# Altium project Cube_Sensor.PrjPcb
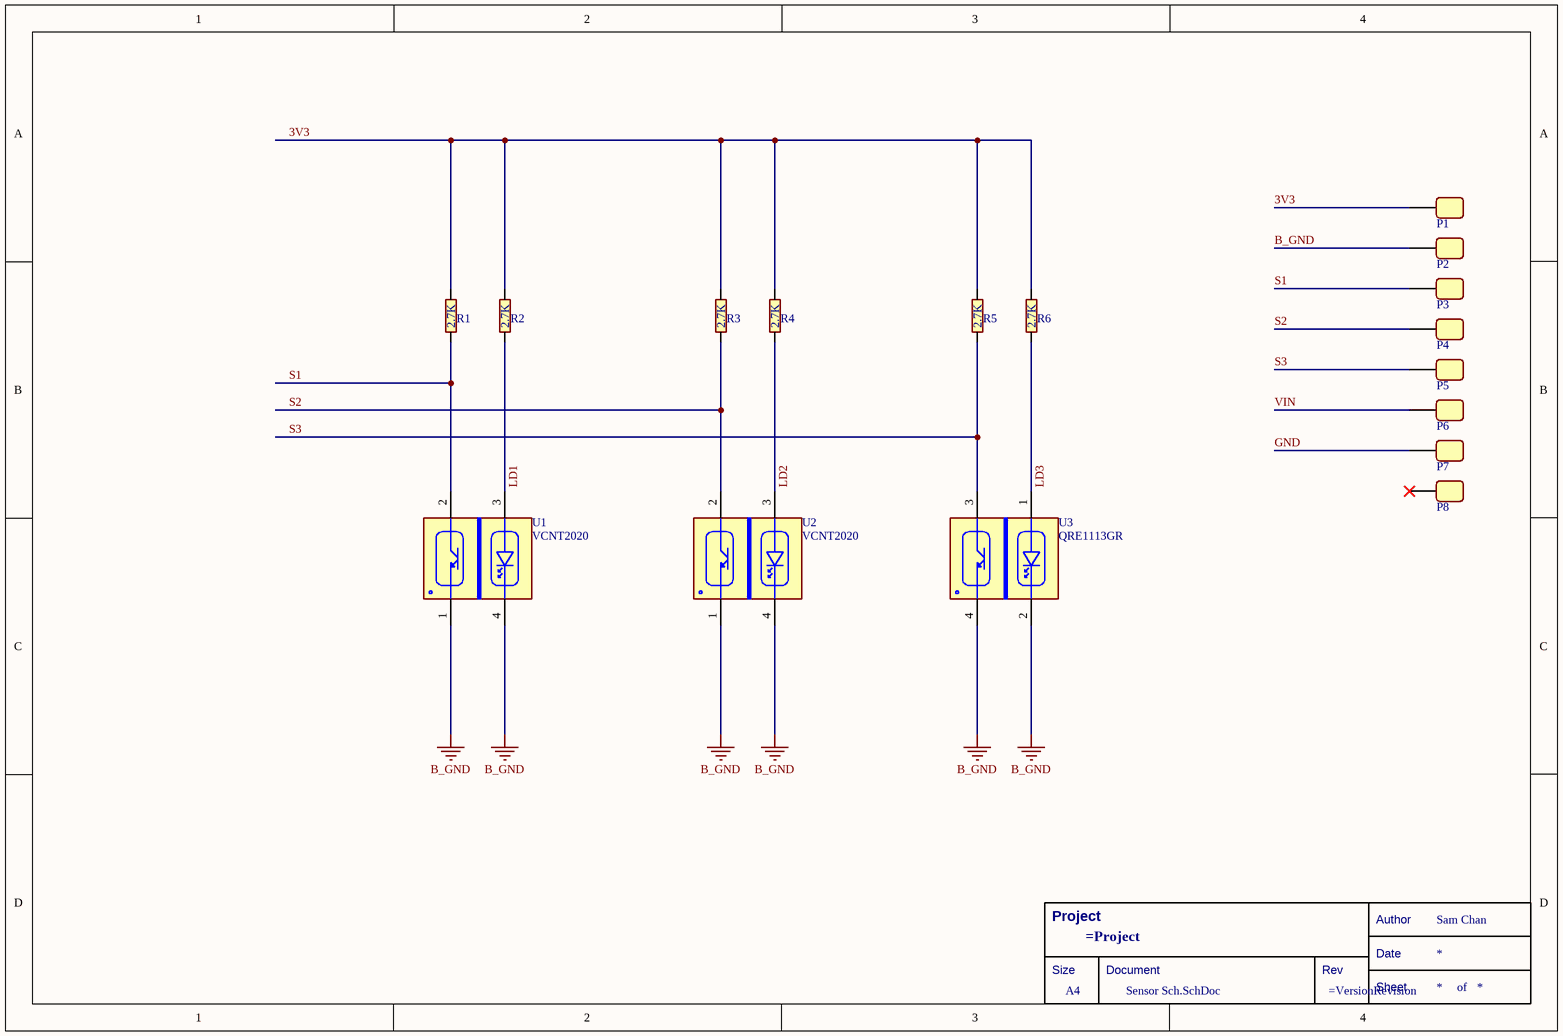
[diagram p0: Sensor Sch.SchDoc]
1 sheet, 18 parts. Net scope: global (net labels, ports and power ports of the same name join across sheets).
Board files: A PCB.PcbDoc, B PCB.PcbDoc, C PCB.PcbDoc

## Sheet Sensor Sch.SchDoc
size A4

### Parts
*  Title Block  (value not drawn)  (graphical)
P1  PAD_4  [PAD_0.5X1MM]  (value not drawn)  (no BOM)
P2  PAD_4  [PAD_0.5X1MM]  (value not drawn)  (no BOM)
P3  PAD_4  [PAD_0.5X1MM]  (value not drawn)  (no BOM)
P4  PAD_4  [PAD_0.5X1MM]  (value not drawn)  (no BOM)
P5  PAD_4  [PAD_0.5X1MM]  (value not drawn)  (no BOM)
P6  PAD_4  [PAD_0.5X1MM]  (value not drawn)  (no BOM)
P7  PAD_4  [PAD_0.5X1MM]  (value not drawn)  (no BOM)
P8  PAD_4  [PAD_0.5X1MM]  (value not drawn)  (no BOM)
R1  2.7K  [RESC0402X04N]
R2  2.7K  [RESC0402X04N]
R3  2.7K  [RESC0402X04N]
R4  2.7K  [RESC0402X04N]
R5  2.7K  [RESC0402X04N]
R6  2.7K  [RESC0402X04N]
U1  VCNT2020  [VCNT2020]
U2  VCNT2020  [VCNT2020]
U3  QRE1113GR  [QRE1113GR]

### Nets
B_GND: P2.1 U1.1 U1.4 U2.1 U2.4 U3.2 U3.4
3V3: P1.1 R1.2 R2.2 R3.2 R4.2 R5.2 R6.2
GND: P7.1
LD1: R2.1 U1.3
LD2: R4.1 U2.3
LD3: R6.1 U3.1
S1: P3.1 R1.1 U1.2
S2: P4.1 R3.1 U2.2
S3: P5.1 R5.1 U3.3
VIN: P6.1

Not connected (* = marked no-connect by the designer): P8 1*

### Notes on the sheet
- (in symbol Title Block) Project; Author; Sam Chan; Date; Size; Document; Rev; A4; Sheet; of

### Library data of the parts
* = Title Block: Standard Title Block
P1-P8 = PAD_4: a Rec pad, 0.5X1mm
R1-R6 = RES 2.7K: RES SMD 2.7K OHM 1% 1/16W 0402; Manufacturer: YAGEO; Manufacturer Part Number: AC0402FR-072K7L; Category: Resistors; Package / Case: 0402; Supplier 1: LCSC; Supplier Part Number 1: C144771; Resistance: 2.7K
U1 U2 = VCNT2020: REFLECTIVE SENSOR WITH PTR OUTPU; Manufacturer: Vishay Semiconductor Opto Division; Category: Optical Sensors; Case: 4-SMD Module; Manufacturer Part Number: VCNT2020; Supplier 1: RS; Supplier Part Number 1: 161-2156
U3 = QRE1113GR: SENSOR OPTO TRANS REFL SMD PHOTO; Manufacturer: ON Semiconductor; Category: Optical Sensors; Case: 4-SMD Module; Manufacturer Part Number: QRE1113GR